# EAGLE design xmega_breakout (EAGLE 6.5.0)
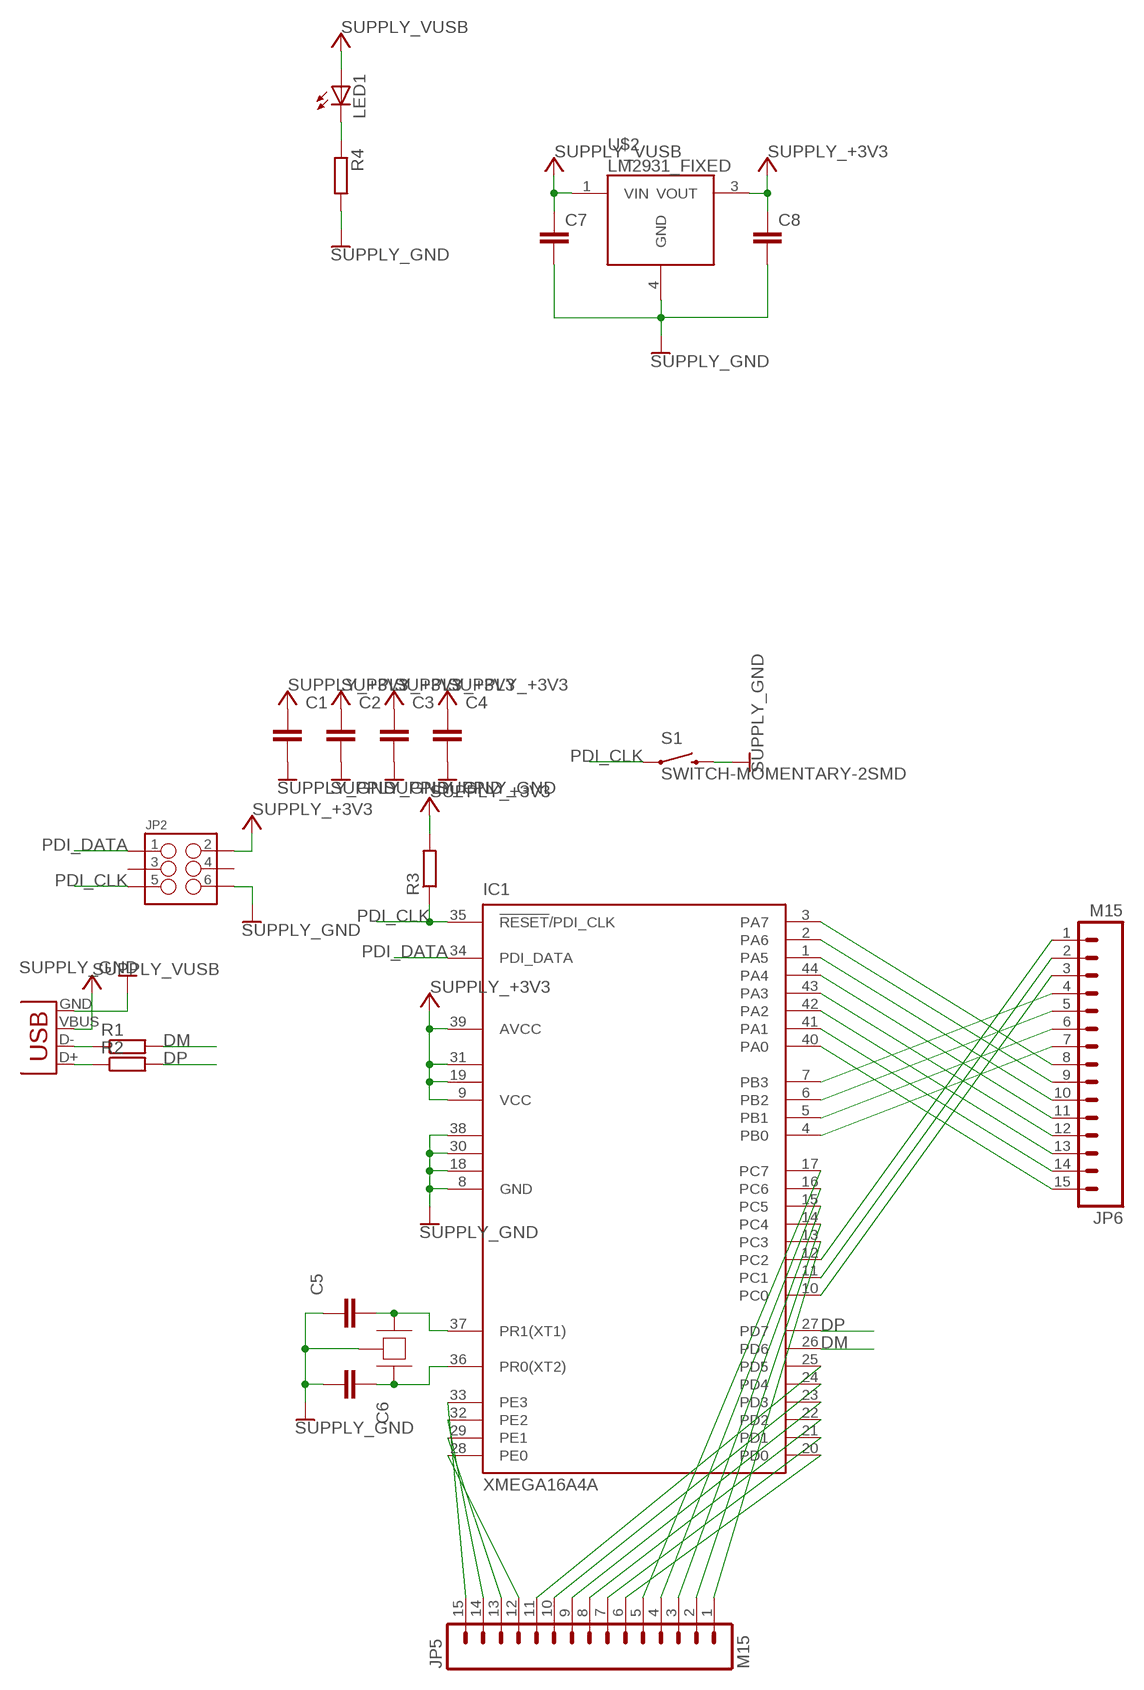
[diagram p0: schematic, sheet 1]

## Parts
C1  CAPACITOR_NPOL-0402  [C402]
C2  CAPACITOR_NPOL-0402  [C402]
C3  CAPACITOR_NPOL-0402  [C402]
C4  CAPACITOR_NPOL-0402  [C402]
C5  CAPACITOR_NPOL-0402  [C402]
C6  CAPACITOR_NPOL-0402  [C402]
C7  C-EUC1210  [C1210]
C8  C-EUC1210  [C1210]
IC1  XMEGA16A4A  [TQFP44]
JP1  USBSMD  [USB-MINIB]
JP2  M03X22X3_SILK_SM  [2X3]
JP5  M15  [1X15]
JP6  M15  [1X15]
LED1  LED-0603  [LED-603]
R1  RESISTOR-0402  [R402]
R2  RESISTOR-0402  [R402]
R3  RESISTOR-0402  [R402]
R4  RESISTOR-0603  [R603]
S1  SWITCH-MOMENTARY-2SMD  [TACTILE_SWITCH_SMD]
U$1  CRYSTAL-3.2X2.5  [TSX-3225]
U$2  LM2931_FIXED  [DPAK]

## Nets
+3V3: C1.1 C2.1 C3.1 C4.1 C8.1 IC1.9(VCC) IC1.19(VCC1) IC1.31(VCC2) IC1.39(AVCC) JP2.2 R3.2 U$2.3(VOUT) ; supply symbol labelled SUPPLY_+3V3
DM: IC1.26(PD6) R1.2
DP: IC1.27(PD7) R2.2
GND: C1.2 C2.2 C3.2 C4.2 C5.1 C6.2 C7.2 C8.2 IC1.8(GND) IC1.18(GND1) IC1.30(GND2) IC1.38(GND3) JP1.GND JP2.6 R4.2 S1.3 U$1.G1(GND) U$1.G2(GND) U$2.4(GND) ; supply symbol labelled SUPPLY_GND
N$1: C5.2 IC1.37(PR1(XT1)) U$1.C1
N$2: C6.1 IC1.36(PR0(XT2)) U$1.C2
N$3: JP1.D- R1.1
N$4: JP1.D+ R2.1
N$5: IC1.33(PE3) JP5.15
N$6: IC1.32(PE2) JP5.14
N$7: IC1.29(PE1) JP5.13
N$8: IC1.28(PE0) JP5.12
N$9: IC1.25(PD5) JP5.11
N$10: IC1.24(PD4) JP5.10
N$11: IC1.23(PD3) JP5.9
N$12: IC1.22(PD2) JP5.8
N$13: IC1.21(PD1) JP5.7
N$14: IC1.20(PD0) JP5.6
N$15: IC1.17(PC7) JP5.5
N$16: IC1.16(PC6) JP5.4
N$17: IC1.15(PC5) JP5.3
N$18: IC1.14(PC4) JP5.2
N$19: IC1.13(PC3) JP5.1
N$20: IC1.12(PC2) JP6.1
N$21: IC1.11(PC1) JP6.2
N$22: IC1.10(PC0) JP6.3
N$23: IC1.7(PB3) JP6.4
N$24: IC1.6(PB2) JP6.5
N$25: IC1.5(PB1) JP6.6
N$26: IC1.4(PB0) JP6.7
N$27: IC1.3(PA7) JP6.8
N$28: IC1.2(PA6) JP6.9
N$29: IC1.1(PA5) JP6.10
N$30: IC1.44(PA4) JP6.11
N$31: IC1.43(PA3) JP6.12
N$32: IC1.42(PA2) JP6.13
N$33: IC1.41(PA1) JP6.14
N$34: IC1.40(PA0) JP6.15
N$35: LED1.C R4.1
PDI_CLK: IC1.35(!RESET!/PDI_CLK) JP2.5 R3.1 S1.1
PDI_DATA: IC1.34(PDI_DATA) JP2.1
VUSB: C7.1 JP1.VBUS LED1.A U$2.1(VIN) ; supply symbol labelled SUPPLY_VUSB
Unconnected: JP2.3 JP2.4

## Library data of the parts
C1-C6 = dp_devices:CAPACITOR_NPOL: Non-Polarized capacitor in various packages
C7 C8 = rcl:C-EU: CAPACITOR, European symbol
IC1 = atmel:XMEGA16A4: MICROCONTROLLER Features High-performance, Low-power 8/16-bit AVR XMEGA Microcontroller Non-Volatile Program and Data Memories - 16 KB - 128 KB of In-System Self-Programmable Flash - 4 KB - 8 KB Boot Code Section with Independent Lock Bits - 1 KB - 2 KB EEPROM - 2 KB - 8 KB Internal SRAM Peripheral Features - Four-channel DMA Controller with support for external requests - Eight-channel Event System - Five 16-bit Timer/Counters Three Timer/Counters with 4 Output Compare or Input Capture channels Two Timer/Counters with 2 Output Compare or Input Capture channels High-Resolution Extensions on all Timer/Counters Advanced Waveform Extension on one Timer/Counter - Five USARTs IrDA Extension on one USART - Two Two-Wire Interfaces with dual address match (I2C and SMBus compatible) - Two SPIs (Serial Peripheral Interfaces) peripherals - AES and DES Crypto Engine - 16-bit Real Time Counter with Separate Oscillator - One Twelve-channel, 12-bit, 2 Msps Analog to Digital Converter - One Two-channel, 12-bit, 1 Msps Digital to Analog Converter - Two Analog Comparators with Window compare function - External Interrupts on all General Purpose I/O pins - Programmable Watchdog Timer with Separate On-chip Ultra Low Power Oscillator Special Microcontroller Features - Power-on Reset and Programmable Brown-out Detection - Internal and External Clock Options with PLL - Programmable Multi-level Interrupt Controller - Sleep Modes: Idle, Power-down, Standby, Power-save, Extended Standby - Advanced Programming, Test and Debugging Interfaces PDI (Program and Debug Interface) for programming, test and debugging I/O and Packages - 34 Programmable I/O Lines - 44 - lead TQFP - 44 - pad VQFN/QFN - 49 - ball VFBGA Operating Voltage - 1.6 - 3.6V Speed performance - 0 - 12 MHz @ 1.6 - 3.6V - 0 - 32 MHz @ 2.7 - 3.6V Drawn by Dipl.-Ing. (FH) Robert Siegler Created: 27.05.09; OC_FARNELL: unknown; OC_NEWARK: unknown
JP1 = SparkFun-Connectors:USB: USB Connectors USB-B-PTH is fully proven SKU : PRT-00139/CONN-08278 USB-miniB is fully proven SKU : PRT-00587 USB-A-PCB is untested. USB-A-H is throughly reviewed, but untested. Spark Fun Electronics SKU : PRT-00437 USB-B-SMT is throughly reviewed, but untested. Needs silkscreen touching up. USB-A-S has not been used/tested USB-MB-H has not been used/tested USB-MICROB has been used. CONN-09505
JP2 = SparkFun-Connectors:M03X2: 2x3 .1" header. Shrouded, with keying- CONN-10681 SMT- CONN-11415 Pogo pins- HW-11044
JP5 JP6 = SparkFun-Connectors:M15: Header 15 Standard 15-pin 0.1" header. Use with straight break away headers (SKU : PRT-00116), right angle break away headers (PRT-00553), swiss pins (PRT-00743), machine pins (PRT-00117), and female headers (PRT-00115).
LED1 = dp_devices:LED: Light Emitting Diode
R1-R4 = dp_devices:RESISTOR
S1 = SparkFun-Electromechanical:SWITCH-MOMENTARY-2: Various NO switches- pushbuttons, reed, etc
U$1 = blackbox:CRYSTAL
U$2 = SparkFun-PowerIC:LM2931_FIXED: LDO regulator with reverse battery protection- very durable!

## Board
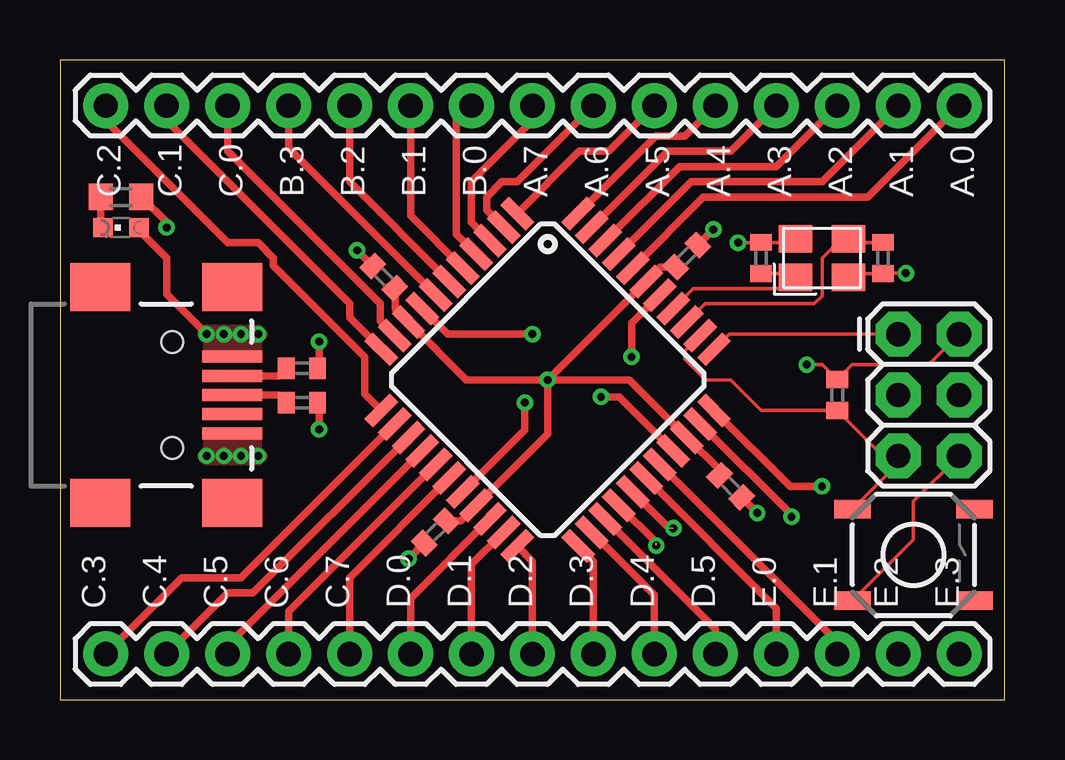
[diagram p1: board, top side]
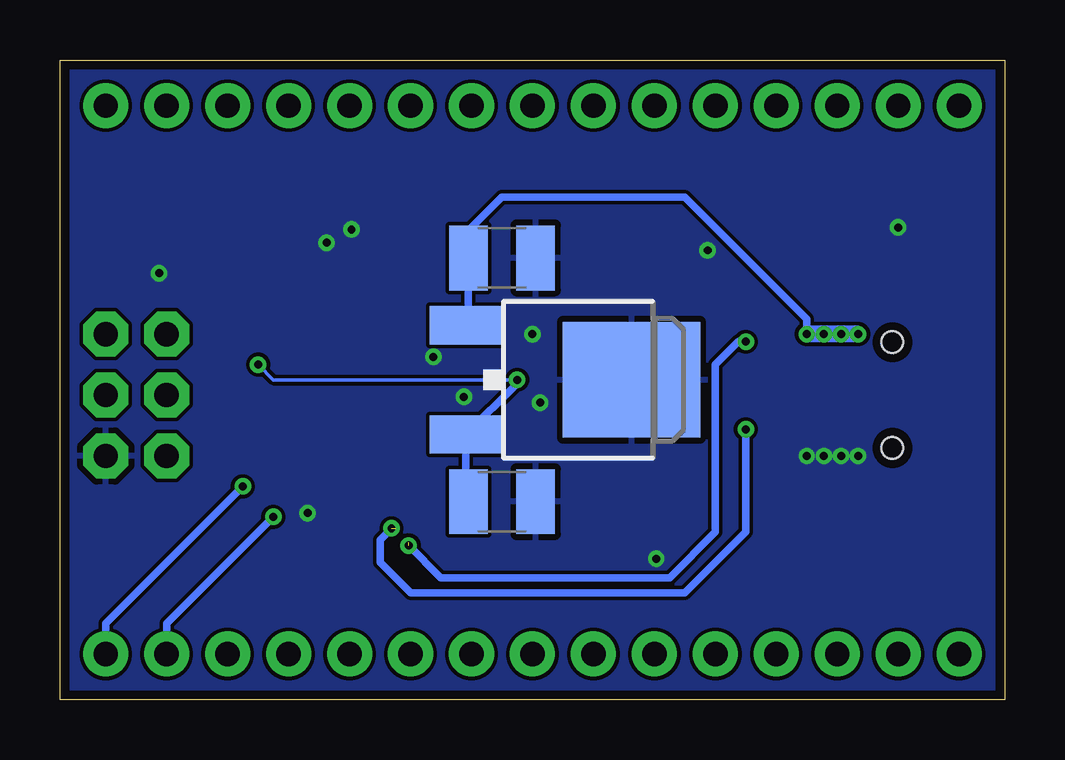
[diagram p2: board, bottom side, seen from below]

Size 39.37 x 26.67 mm. Coordinates in mm from the lower left corner, seen from the top.
Outline: 0,0 39.37,0 39.37,26.67 0,26.67 0,0
Copper layers (1*16): Top 0.0356mm / dielectric 1.5011mm / Bottom 0.0356mm
Design rules "LaenPCBOrder *": minimum track width 6mil, minimum drill 13mil, track to track 6mil, track to pad 6mil, pad to pad 6mil, via to via 6mil, smd to smd 6mil, copper to edge 15mil, drill to drill 6mil, minimum pad ring 7mil, minimum via ring 7mil, stop-mask expansion 4mil, vias tented up to drill 15mil, thermal gap 10mil

### Footprints (pad centres in the part's own frame; a part is rotated, then mirrored left to right if it is on the bottom)
C402 = smd 0.7 x 0.9: 1 -0.65,0; 2 0.65,0
C1210 = smd 1.6 x 2.7: 1 -1.4,0; 2 1.4,0
TQFP44 = smd 1.5 x 0.5: 1 -5.8,4; 2 -5.8,3.2; 3 -5.8,2.4; 4 -5.8,1.6; 5 -5.8,0.8; 6 -5.8,0; 7 -5.8,-0.8; 8 -5.8,-1.6; 9 -5.8,-2.4; 10 -5.8,-3.2; 11 -5.8,-4; 23 5.8,-4; 24 5.8,-3.2; 25 5.8,-2.4; 26 5.8,-1.6; 27 5.8,-0.8; 28 5.8,0; 29 5.8,0.8; 30 5.8,1.6; 31 5.8,2.4; 32 5.8,3.2; 33 5.8,4 | smd 0.5 x 1.5: 12 -4,-5.8; 13 -3.2,-5.8; 14 -2.4,-5.8; 15 -1.6,-5.8; 16 -0.8,-5.8; 17 0,-5.8; 18 0.8,-5.8; 19 1.6,-5.8; 20 2.4,-5.8; 21 3.2,-5.8; 22 4,-5.8; 34 4,5.8; 35 3.2,5.8; 36 2.4,5.8; 37 1.6,5.8; 38 0.8,5.8; 39 0,5.8; 40 -0.8,5.8; 41 -1.6,5.8; 42 -2.4,5.8; 43 -3.2,5.8; 44 -4,5.8
USB-MINIB = smd 2.5 x 0.5: D+ 2.5,0; D- 2.5,0.8; GND 2.5,-1.6; ID 2.5,-0.8; VBUS 2.5,1.6 | smd 2.5 x 2: MTN1 -3,4.5; MTN2 2.5,4.5; MTN3 -3,-4.5; MTN4 2.5,-4.5 | hole 0.9: 0,2.2; 0,-2.2
2X3 = drill 1.016 pad 1.88 octagon: 1 0,0; 2 0,2.54; 3 2.54,0; 4 2.54,2.54; 5 5.08,0; 6 5.08,2.54
1X15 = drill 1.016 pad 1.88: 1 0,0; 2 2.54,0; 3 5.08,0; 4 7.62,0; 5 10.16,0; 6 12.7,0; 7 15.24,0; 8 17.78,0; 9 20.32,0; 10 22.86,0; 11 25.4,0; 12 27.94,0; 13 30.48,0; 14 33.02,0; 15 35.56,0
LED-603 = smd 0.8 x 0.8: A 0,-0.75; C 0,0.75
R402 = smd 0.7 x 0.9: 1 -0.65,0; 2 0.65,0
R603 = smd 1 x 1.1: 1 -0.85,0; 2 0.85,0
TACTILE_SWITCH_SMD = smd 1.524 x 0.762: 1 -2.54,1.905; 2 2.54,1.905; 3 -2.54,-1.905; 4 2.54,-1.905
TSX-3225 = smd 1.4 x 1.15: C1 -1.1,-0.8; C2 1.1,0.8; G1 -1.1,0.8; G2 1.1,-0.8
DPAK = smd 1.6 x 3: 1 -2.28,-5.31; 3 2.28,-5.31 | smd 4.826 x 5.715: 4 0,1.588

### Placement (x,y rotation side)
C1  15.64,6.99 225 top
C2  13.49,17.62 135 top
C3  26.11,18.49 45 top
C4  27.94,8.89 315 top
C5  29.21,18.41 270 top
C6  34.29,18.41 270 top
C7  20.95,18.41 0 bottom
C8  20.95,8.26 0 bottom
IC1  20.32,13.34 315 top
JP1  4.68,12.7 0 top
JP2  34.92,15.24 270 top
JP5  1.91,1.91 0 top
JP6  1.91,24.77 0 top
LED1  2.54,19.68 90 top
R1  10.08,13.81 0 top
R2  10.08,12.38 0 top
R3  32.38,12.7 90 top
R4  2.54,20.95 0 top
S1  35.56,6.03 0 top
U$1  31.75,18.41 0 top
U$2  17.14,13.34 270 bottom

### Tracks (layer width: path | path; a pad name or v marks a point on that pad's centre or on a via)
+3V3  (via drill 0.33)
  Top 0.152: JP2.2 36.2,13.97 33.01,13.97 R3.2 31.77,13.97 v31.11,13.97
  Top 0.305: v20.32,13.34 23.71,13.34 IC1.31 27.48,9.57 C4.1 | v20.32,13.34 IC1.39 25.02,18.04 C3.1 | v20.32,13.34 20.32,11.07 IC1.19 16.69,7.45 C1.1 | v20.32,13.34 16.93,13.34 IC1.9 13.97,16.29 13.97,17.14 C2.1
  Bottom 0.152: v31.11,13.97 30.48,13.34 v20.32,13.34
  Bottom 0.305: C8.1 22.45,8.36 U$2.3 20.32,13.19 v20.32,13.34
DM  (via drill 0.33)  (1 unrouted)
  Top 0.305: R1.2 10.79,13.88 v10.79,14.92 | IC1.26 24.84,6.55
  Bottom 0.305: v24.84,6.43 23.5,5.08 13.97,5.08 12.06,6.99 12.06,13.97 11.11,14.92 v10.79,14.92
DP  (via drill 0.33)  (1 unrouted)
  Top 0.305: R2.2 10.79,12.32 v10.79,11.27 | IC1.27 25.38,7.14
  Bottom 0.305: v25.56,7.14 26.04,6.67 26.04,5.71 24.77,4.45 13.34,4.45 10.79,6.99 v10.79,11.27
GND  (via drill 0.33)
  Top 0.152: S1.3 35.56,6.67 35.56,8.26 JP2.6 | U$1.G1 30.5,19.07 C5.1 29.2,19.05 v28.26,19.05 | U$1.G2 33,17.77 C6.2 34.3,17.78 v35.24,17.78
  Top 0.305: IC1.8 16.15,15.24 v19.68,15.24 | IC1.18 19.37,11.25 v19.37,12.38 | IC1.38 23.81,15.7 v23.81,14.29 | IC1.30 23.3,12.62 v22.54,12.62 | C3.2 v27.23,19.61 | C2.2 | C2.2 v12.38,18.73 | C1.2 v14.53,5.87 | C4.2 v29.05,7.78 | v29.05,7.78 | R4.2 4.45,19.9 v4.45,19.68
  other vias: 8.26,10.16 7.54,10.16 6.83,10.16 6.11,10.16
  pour Bottom: 0,0 39.37,0 39.37,26.67 0,26.67
  pour Top (no thermals): 8.33,11.27 8.33,10.48 8.49,10.32 8.57,10.24 8.57,10.16 8.57,10.08 8.41,9.92 8.33,9.84 6.11,9.84 6.03,9.84 5.87,10 5.79,10.08 5.79,10.16 5.79,10.24 5.95,10.4 6.03,10.48 6.03,11.27
N$1
  Top 0.152: IC1.37 26.39,17.14 30.18,17.14 U$1.C1 30.5,17.77 C5.2
N$2
  Top 0.152: IC1.36 26.89,16.51 31.43,16.51 31.75,16.83 31.75,18.41 32.55,19.21 U$1.C2 33,19.07 C6.1
N$3
  Top 0.305: JP1.D- 9.12,13.5 R1.1
N$4
  Top 0.305: JP1.D+ 9.11,12.7 R2.1
N$5  (via drill 0.33)
  Top 0.305: IC1.33 30.42,8.89 v31.75,8.89
  Bottom 0.305: v31.75,8.89 37.47,3.17 JP5.15
N$6  (via drill 0.33)
  Top 0.305: IC1.32 30.48,7.7 v30.48,7.62
  Bottom 0.305: v30.48,7.62 34.92,3.17 JP5.14
N$7
  Top 0.305: IC1.29 32.38,2.4 JP5.13
N$8
  Top 0.305: IC1.28 29.84,3.81 JP5.12
N$9
  Top 0.305: IC1.25 27.3,2.96 JP5.11
N$10
  Top 0.305: IC1.24 24.77,4.37 JP5.10
N$11
  Top 0.305: IC1.23 22.23,5.77 JP5.9
N$12
  Top 0.305: IC1.22 19.68,5.77 JP5.8
N$13
  Top 0.305: IC1.21 17.14,5.63 JP5.7
N$14
  Top 0.305: IC1.20 14.61,4.23 JP5.6
N$15
  Top 0.305: IC1.17 12.06,5.08 JP5.5
N$16
  Top 0.305: IC1.16 9.53,3.67 JP5.4
N$17
  Top 0.305: IC1.15 6.99,2.26 JP5.3
N$18
  Top 0.305: IC1.14 8.04,4.45 6.99,4.45 JP5.2
N$19
  Top 0.305: IC1.13 7.54,5.08 5.08,5.08 JP5.1
N$20
  Top 0.305: IC1.12 12.7,12.75 12.7,14.29 8.89,18.1 8.89,18.41 8.26,19.05 6.99,19.05 1.91,24.13 JP6.1
N$21
  Top 0.305: IC1.11 12.06,15.93 12.06,16.51 4.45,24.13 JP6.2
N$22
  Top 0.305: IC1.10 13.34,15.79 13.34,16.51 6.99,22.86 JP6.3
N$23
  Top 0.305: IC1.7 9.53,23 JP6.4
N$24
  Top 0.305: IC1.6 12.06,21.59 JP6.5
N$25
  Top 0.305: IC1.5 14.61,20.18 JP6.6
N$26
  Top 0.305: IC1.4 16.51,19.41 16.51,24.13 JP6.7
N$27
  Top 0.305: IC1.3 17.14,19.9 17.14,21.59 19.68,24.13 JP6.8
N$28
  Top 0.305: IC1.2 17.78,20.4 17.78,20.95 18.41,21.59 19.05,21.59 JP6.9
N$29
  Top 0.305: IC1.1 21.64,22.86 22.86,22.86 JP6.10
N$30
  Top 0.305: IC1.44 24.82,23.5 26.04,23.5 JP6.11
N$31
  Top 0.305: JP6.12 27.94,22.86 25.32,22.86 IC1.43
N$32
  Top 0.305: JP6.13 29.84,22.23 25.82,22.23 IC1.42
N$33
  Top 0.305: JP6.14 31.75,21.59 26.31,21.59 IC1.41
N$34
  Top 0.305: JP6.15 33.66,20.95 26.81,20.95 IC1.40
N$35
  Top 0.305: LED1.C 1.69,19.79 R4.1
PDI_CLK
  Top 0.152: IC1.35 26.04,14.53 26.04,14.21 26.91,13.34 27.94,13.34 29.23,12.05 R3.1 34.27,10.16 JP2.5 34.92,9.84 S1.1
PDI_DATA
  Top 0.152: IC1.34 27.88,15.24 JP2.1
VUSB  (via drill 0.33)
  Top 0.305: v6.11,15.24 4.45,16.91 4.45,18.41 3.29,19.57 LED1.A
  Bottom 0.305: U$2.1 22.36,15.71 C7.1 22.36,19.55 20.95,20.95 13.34,20.95 8.26,15.88 v8.26,15.24
  Bottom 0.711: v6.11,15.24 v8.26,15.24
  other vias: 6.83,15.24 7.54,15.24
  pour Top (no thermals): 6.03,14.13 6.03,14.92 5.87,15.08 5.79,15.16 5.79,15.24 5.79,15.32 5.95,15.48 6.03,15.56 8.26,15.56 8.33,15.56 8.49,15.4 8.57,15.32 8.57,15.24 8.57,15.16 8.41,15 8.33,14.92 8.33,14.13

### Text on the board
tPlace: C.2 | C.1 | C.0 | B.3 | B.2 | B.1 | B.0 | A.7 | A.6 | A.5 | A.4 | A.3 | A.2 | A.1 | A.0 | C.3 | C.4 | C.5 | C.6 | C.7 | D.0 | D.1 | D.2 | D.3 | D.4 | D.5 | E.0 | E.1 | E.2 | E.3